# EAGLE design Paige_conductive (EAGLE 9.0.1)
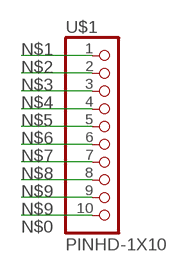
[diagram p0: schematic, sheet 1]

## Parts
U$1  PINHD-1X10  [1X10-BIG]

## Nets
N$0: U$1.10
N$1: U$1.1
N$2: U$1.2
N$3: U$1.3
N$4: U$1.4
N$5: U$1.5
N$6: U$1.6
N$7: U$1.7
N$8: U$1.8
N$9: U$1.9

## Library data of the parts
U$1 = adafruit:PINHD-1X10: Pin header 1x10 0.1" spacing With round pins

## Board
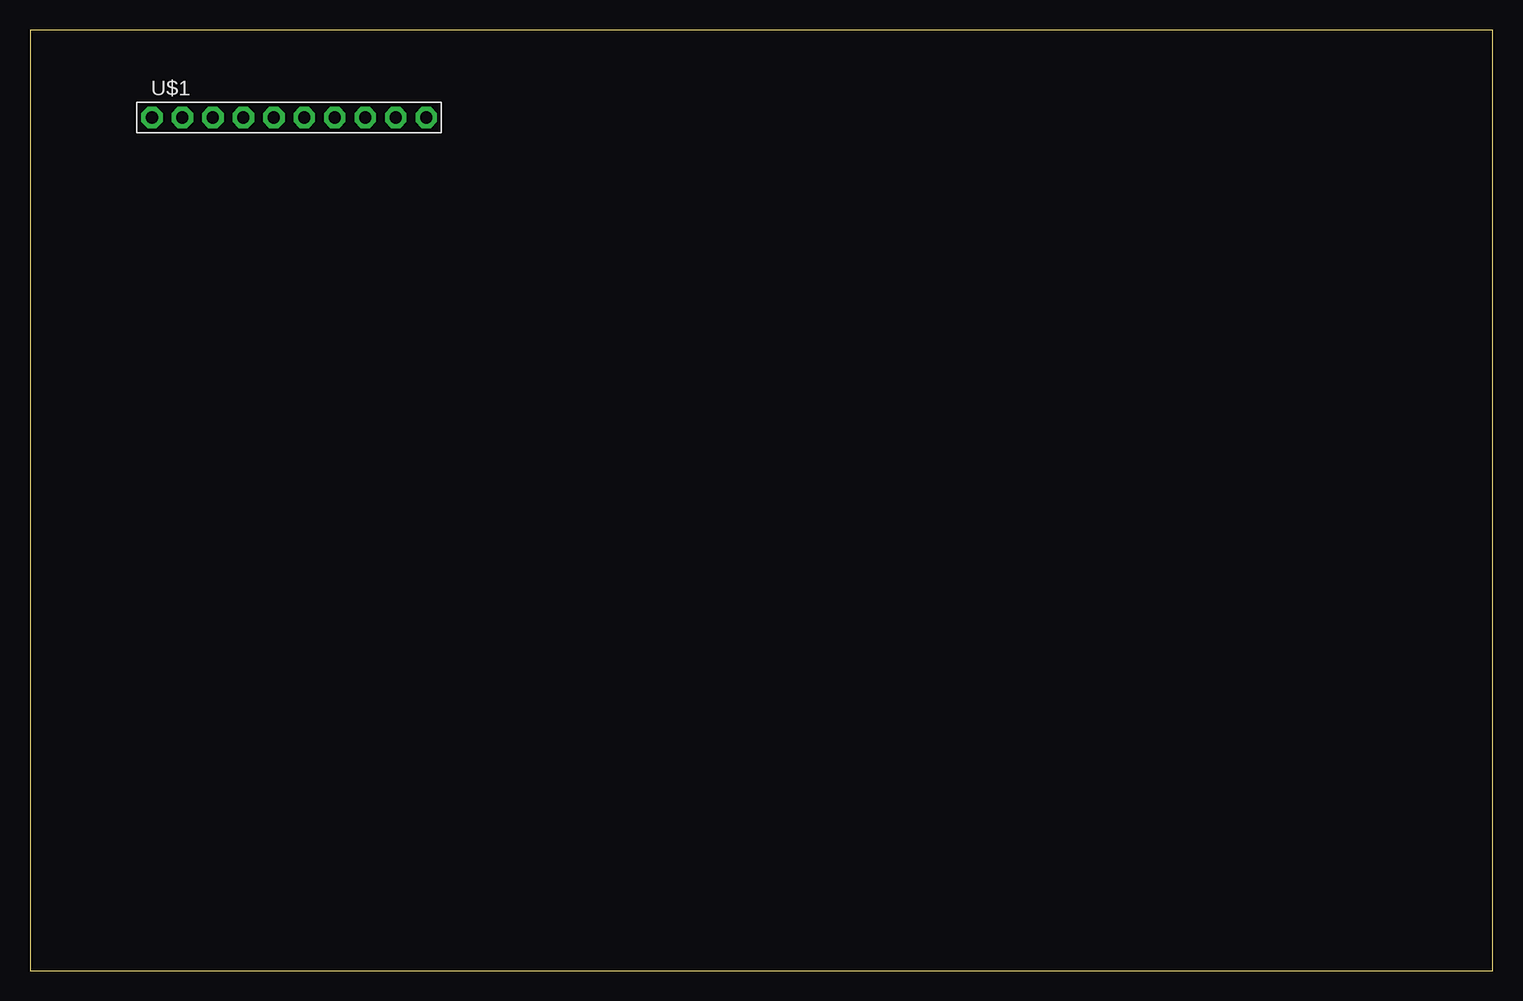
[diagram p1: board, top side]
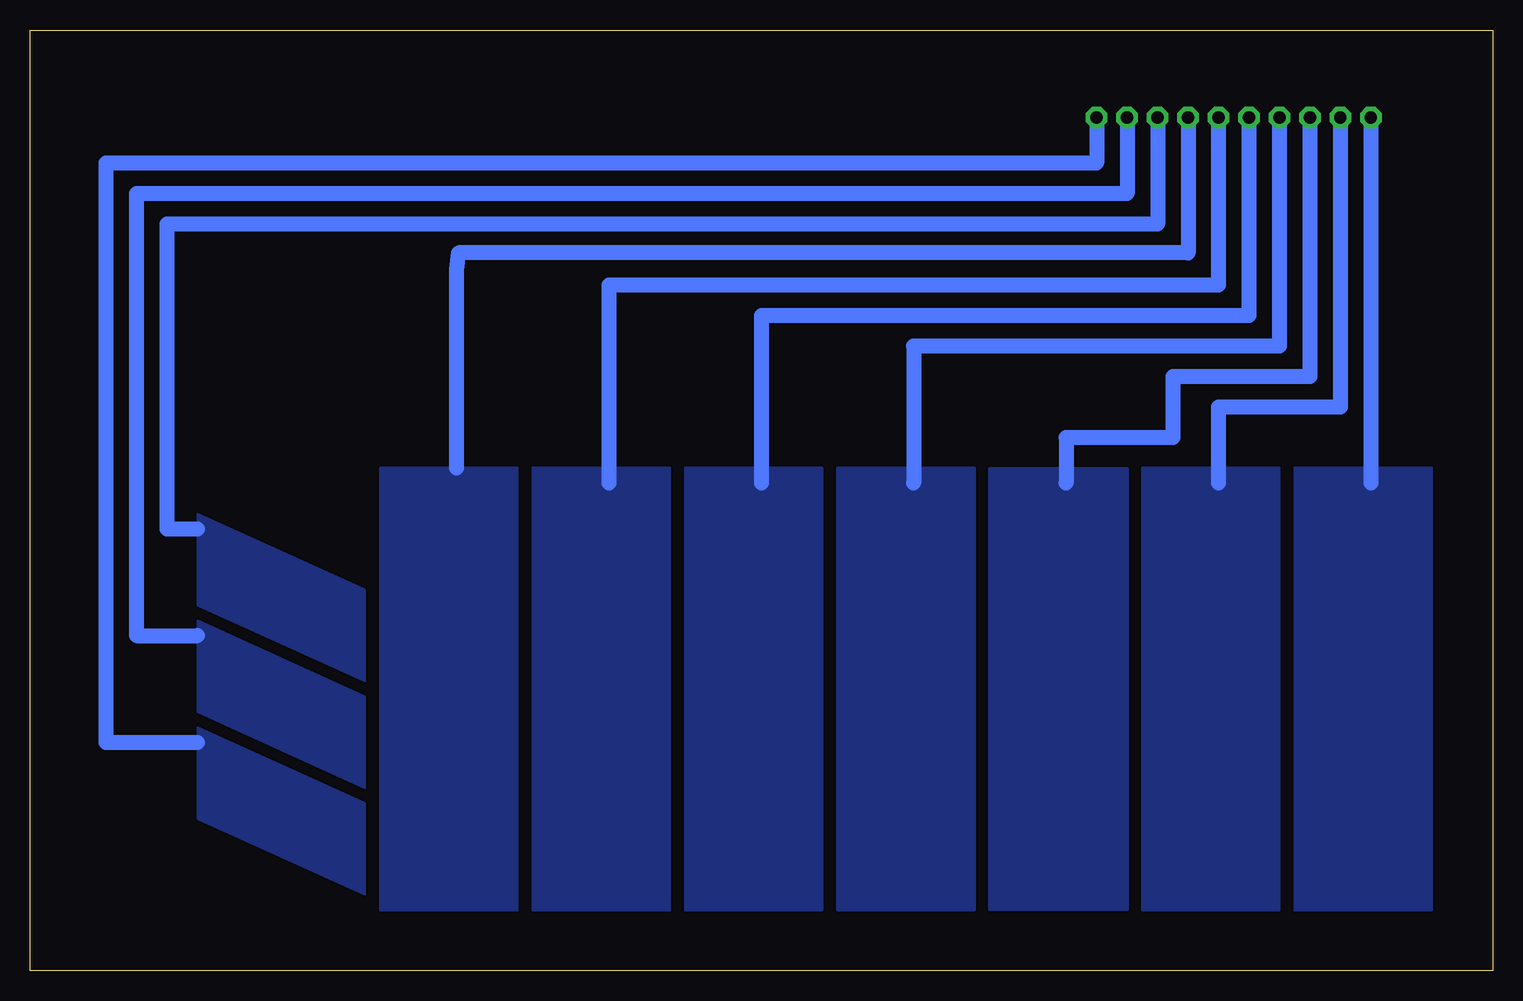
[diagram p2: board, bottom side, seen from below]

Size 121.9 x 78.41 mm. Coordinates in mm from the lower left corner, seen from the top.
Outline: 0,0 121.9,0 121.9,78.41 0,78.41 0,0
Copper layers (1*16): Top 0.035mm / dielectric 1.5mm / Bottom 0.035mm
Design rules "default": minimum track width 6mil, minimum drill 0.35mm, track to track 6mil, track to pad 6mil, pad to pad 6mil, via to via 6mil, smd to smd 6mil, copper to edge 40mil, drill to drill 6mil, minimum pad ring 10mil, minimum via ring 8mil, stop-mask expansion 4mil, vias tented up to drill 0mil, thermal gap 10mil

### Footprints (pad centres in the part's own frame; a part is rotated, then mirrored left to right if it is on the bottom)
1X10-BIG = drill 1.016 pad 1.778 octagon: 1 -11.43,0; 2 -8.89,0; 3 -6.35,0; 4 -3.81,0; 5 -1.27,0; 6 1.27,0; 7 3.81,0; 8 6.35,0; 9 8.89,0; 10 11.43,0

### Placement (x,y rotation side)
U$1  21.59,71.12 0 top

### Tracks (layer width: path | path; a pad name or v marks a point on that pad's centre or on a via)
N$0
  Bottom 1.27: U$1.10 33.02,67.31 115.57,67.31 115.57,19.05 107.95,19.05
  pour Bottom: 107.95,20.32 107.95,12.7 93.98,6.35 93.98,13.97
N$1
  Bottom 1.27: U$1.1 10.16,40.64
  pour Bottom: 5.08,41.91 16.51,41.91 16.51,5.08 5.08,5.08
N$2
  Bottom 1.27: U$1.2 12.7,46.99 22.86,46.99 22.86,40.64
  pour Bottom: 17.78,41.91 29.21,41.91 29.21,5.08 17.78,5.08
N$3
  Bottom 1.27: U$1.3 15.24,49.53 26.67,49.53 26.67,44.45 35.56,44.45 35.56,40.64
  pour Bottom: 30.48,41.91 30.48,5.08 41.91,5.08 41.91,41.91
N$4
  Bottom 1.27: U$1.4 17.78,52.07 48.26,52.07 48.26,40.64
  pour Bottom: 43.18,41.91 54.61,41.91 54.61,5.08 43.18,5.08
N$5
  Bottom 1.27: U$1.5 20.32,54.61 60.96,54.61 60.96,40.64
  pour Bottom: 55.88,41.91 67.31,41.91 67.31,5.08 55.88,5.08
N$6
  Bottom 1.27: U$1.6 22.86,57.15 73.66,57.15 73.66,40.64
  pour Bottom: 68.58,41.91 80.01,41.91 80.01,5.08 68.58,5.08
N$7
  Bottom 1.27: U$1.7 25.4,59.84 86.21,59.84 86.36,58.42 86.36,41.91
  pour Bottom: 81.28,41.91 92.71,41.91 92.71,5.08 81.28,5.08
N$8
  Bottom 1.27: U$1.8 27.94,62.23 110.49,62.23 110.49,36.83 107.95,36.83
  pour Bottom: 107.95,38.1 107.95,30.48 93.98,24.13 93.98,31.75
N$9
  Bottom 1.27: U$1.9 30.48,64.77 113.03,64.77 113.03,27.94 107.95,27.94
  pour Bottom: 107.95,29.21 107.95,21.59 93.98,15.24 93.98,22.86